# Altium schematic sheet ABC Maker V1.SchDoc: ABC Maker Kit
size A3; Date: 04/08/2016; Author: Bui Nhu The; CompanyName: Ha Noi Maker; Address1: P901, 100 Hoang Quoc Viet; DocumentNumber: 1; SheetNumber: 1; SheetTotal: 1; Title2: V3.1
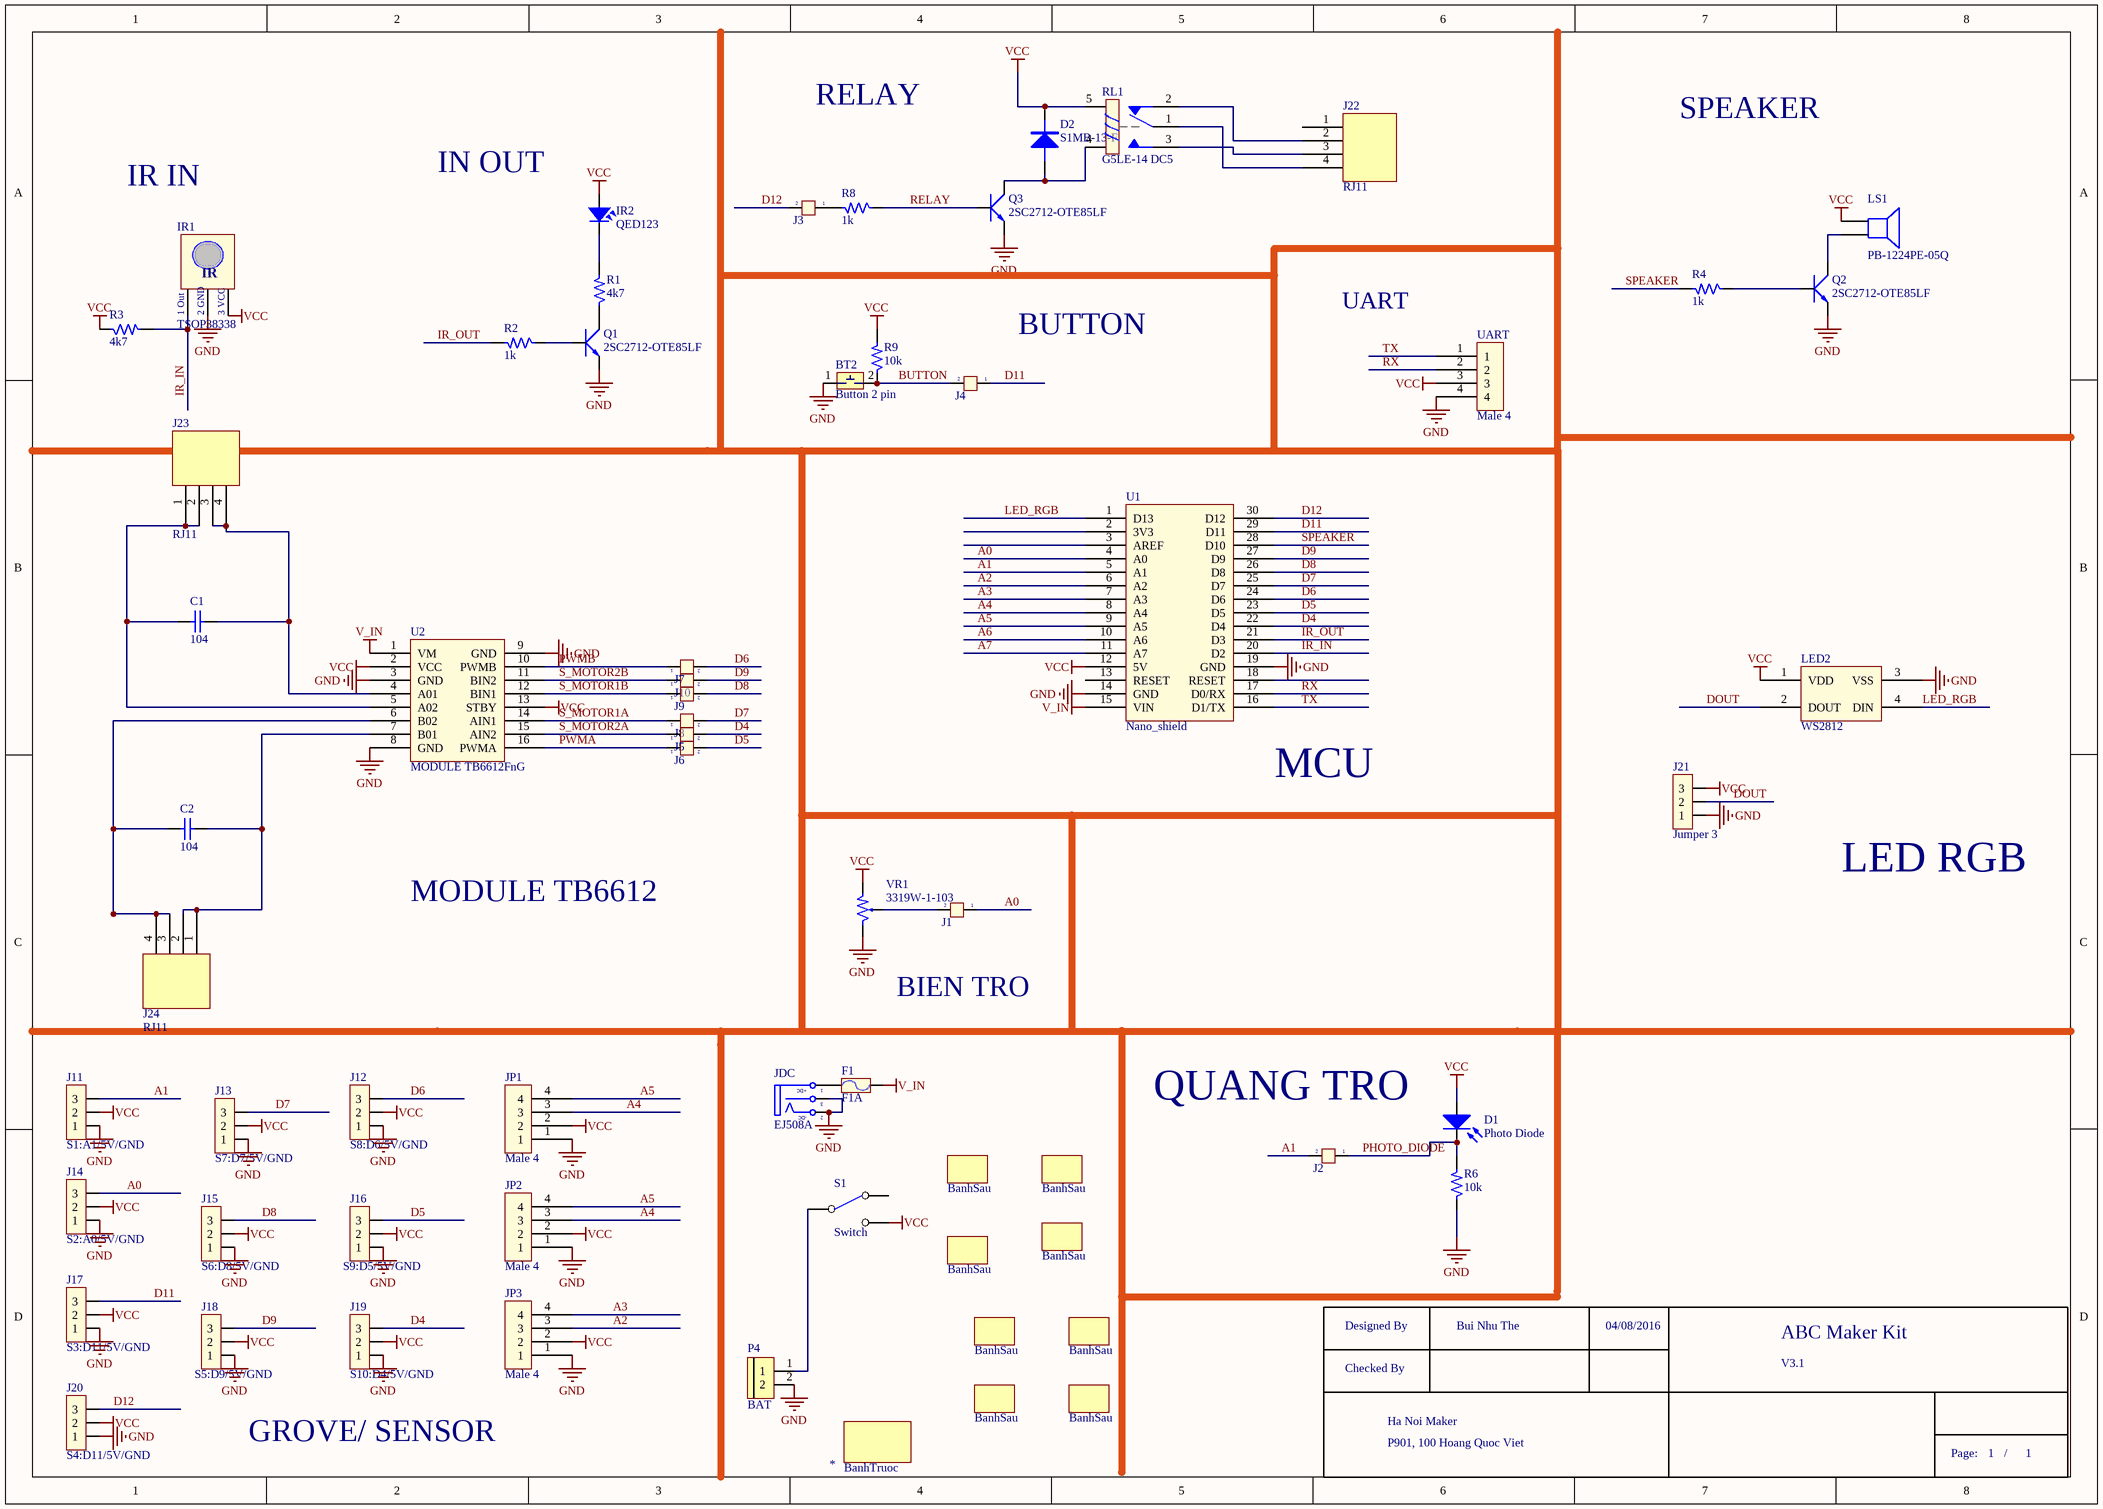
[diagram p0: ABC Maker V1.SchDoc]

## Parts
(Parts that share a designator on the sheet are numbered #1, #2 ... from top to bottom, then left to right.)
*#1  BanhSau  [BanhSau]
*#2  BanhSau  [BanhSau]
*#3  BanhSau  [BanhSau]
*#4  BanhSau  [BanhSau]
*#5  BanhSau  [BanhSau]
*#6  BanhSau  [BanhSau]
*#7  BanhSau  [BanhSau]
*#8  BanhSau  [BanhSau]
*#9  BanhTruoc  [BanhTruoc]
BT2  Button 2 pin
C1  104  [0805]
C2  104  [0805]
D1  Photo Diode  [LED-5 GRe]
D2  S1MB-13-F
F1  F1A  [1206]
IR1  TSOP38338
IR2  QED123
J1  Jumper 2  [JP 2]  (value not drawn)
J2  Jumper 2  [JP 2]  (value not drawn)
J3  Jumper 2  [JP 2]  (value not drawn)
J4  Jumper 2  [JP 2]  (value not drawn)
J5  Jumper 2  [JP 2]  (value not drawn)
J6  Jumper 2  [JP 2]  (value not drawn)
J7  Jumper 2  [JP 2]  (value not drawn)
J8  Jumper 2  [JP 2]  (value not drawn)
J9  Jumper 2  [JP 2]  (value not drawn)
J10  Jumper 2  [JP 2]  (value not drawn)
J11  S1:A1/5V/GND  [JP 3]
J12  S8:D6/5V/GND  [JP 3]
J13  S7:D7/5V/GND  [JP 3]
J14  S2:A0/5V/GND  [JP 3]
J15  S6:D8/5V/GND  [JP 3]
J16  S9:D5/5V/GND  [JP 3]
J17  S3:D11/5V/GND  [JP 3]
J18  S5:D9/5V/GND  [JP 3]
J19  S10:D4/5V/GND  [JP 3]
J20  S4:D11/5V/GND  [JP 3]
J21  Jumper 3  [JP 3]
J22  RJ11
J23  RJ11
J24  RJ11
JDC  EJ508A
JP1  Male 4
JP2  Male 4
JP3  Male 4
LED2  WS2812
LS1  PB-1224PE-05Q
P4  BAT  [CON2]
Q1  2SC2712-OTE85LF
Q2  2SC2712-OTE85LF
Q3  2SC2712-OTE85LF
R1  4k7
R2  1k
R3  4k7
R4  1k
R6  10k
R8  1k
R9  10k
RL1  G5LE-14 DC5
S1  Switch  [Switch]
U1  Nano_shield  [Nano_Shield_Dip]
U2  MODULE TB6612FnG  [TB6612FNG_DIP]
UART  Male 4
VR1  3319W-1-103

## Nets
GND: BT2.1 IR1.2(GND) J11.1 J12.1 J13.1 J14.1 J15.1 J16.1 J17.1 J18.1 J19.1 J20.1 J21.1 JDC.2(TN) JDC.3(S) JP1.1 JP2.1 JP3.1 LED2.3(VSS) P4.2 Q1.1(E) Q2.1(E) Q3.1(E) R6.1 U1.14(GND) U1.19(GND) U2.3(GND) U2.8(GND) U2.9(GND) UART.4 VR1.3
V_IN: F1.2 U1.15(VIN) U2.1(VM)
VCC: D1.1(A) D2.2 IR1.3(VCC) IR2.1 J11.2 J12.2 J13.2 J14.2 J15.2 J16.2 J17.2 J18.2 J19.2 J20.2 J21.3 JP1.2 JP2.2 JP3.2 LED2.1(VDD) LS1.1 R3.1 R9.2 RL1.5 S1.3(NO) U1.12(5V) U2.2(VCC) U2.13(STBY) UART.3 VR1.1
A0: J1.1 J14.3 U1.4(A0)
A1: J2.2 J11.3 U1.5(A1)
A2: JP3.3 U1.6(A2)
A3: JP3.4 U1.7(A3)
A4: JP1.3 JP2.3 U1.8(A4)
A5: JP1.4 JP2.4 U1.9(A5)
A6: U1.10(A6)
A7: U1.11(A7)
BUTTON: BT2.2 J4.2 R9.1
D4: J5.2 J19.3 U1.22(D4)
D5: J6.2 J16.3 U1.23(D5)
D6: J7.2 J12.3 U1.24(D6)
D7: J8.2 J13.3 U1.25(D7)
D8: J9.2 J15.3 U1.26(D8)
D9: J10.2 J18.3 U1.27(D9)
D11: J4.1 J17.3 U1.29(D11)
D12: J3.2 J20.3 U1.30(D12)
DOUT: J21.2 LED2.2(DOUT)
IR_IN: IR1.1(Out) R3.2 U1.20(D2)
IR_OUT: R2.2 U1.21(D3)
LED_RGB: LED2.4(DIN) U1.1(D13)
PHOTO_DIODE: D1.2(K) J2.1 R6.2
PWMA: J6.1 U2.16(PWMA)
PWMB: J7.1 U2.10(PWMB)
RELAY: Q3.3(B) R8.1
RX: U1.17(D0/RX) UART.2
S_MOTOR1A: J8.1 U2.14(AIN1)
S_MOTOR1B: J9.1 U2.12(BIN1)
S_MOTOR2A: J5.1 U2.15(AIN2)
S_MOTOR2B: J10.1 U2.11(BIN2)
SPEAKER: R4.2 U1.28(D10)
TX: U1.16(D1/TX) UART.1
NetC1_1: C1.1 J23.3 J23.4 U2.4(A01)
NetC1_2: C1.2 J23.1 J23.2 U2.5(A02)
NetC2_1: C2.1 J24.1 J24.2 U2.7(B01)
NetC2_2: C2.2 J24.3 J24.4 U2.6(B02)
NetD2_1: D2.1 Q3.2(C) RL1.4
NetF1_1: F1.1 JDC.1(T)
NetIR2_2: IR2.2 R1.2
NetJ1_2: J1.2 VR1.2
NetJ3_1: J3.1 R8.2
NetJ22_2: J22.2 RL1.2
NetJ22_3: J22.3 RL1.3
NetJ22_4: J22.4 RL1.1
NetLS1_2: LS1.2 Q2.2(C)
NetP4_1: P4.1 S1.2(COMMON)
NetQ1_2: Q1.2(C) R1.1
NetQ1_3: Q1.3(B) R2.1
NetQ2_3: Q2.3(B) R4.1

Not connected (* = marked no-connect by the designer): J22 1; S1 1(NC); U1 2(3V3) 3(AREF) 13(RESET) 18(RESET)

## Notes on the sheet
- RELAY
- IN OUT
- SPEAKER
- IR IN
- UART
- BUTTON
- (near U1) MCU
- MODULE TB6612
- LED RGB
- BIEN TRO
- QUANG TRO
- GROVE/ SENSOR
- Designed By
- Checked By
- Page:
- /
- (in symbol EJ508A) +DC; -DC
- (in symbol TSOP38338) IR; 1 Out; 2 GND; 3 VCC

## Library data of the parts
C1 C2 = Cap
D1 = Photo Diode: Photosensitive Diode
D2 = S1MB-13-F: Diode Standard 1000V (1kV) 1A Surface Mount SMB; Manufacturer: Diodes Incorporated; Voltage - Forward (Vf) (Max) @ If: 1.1V @ 1A; Speed: Standard Recovery >500ns, > 200mA (Io); Reverse Recovery Time (trr): 3µs; Current - Reverse Leakage @ Vr: 5µA @ 1000V; Capacitance @ Vr, F: 10pF @ 4V, 1MHz; Supplier 1: Digi-Key; Manufacturer Part Number: S1MB-13-F; RoHS: RoHS Compliant; Category: Discrete Semiconductor Products; Stock 1: 62455; Pricing 1: 1=0.37, 10=0.272, 100=0.1538, 500=0.10198, 1000=0.07821 (USD); Packaging: Cut Tape (CT); Part Status: Active; Diode Type: Standard; Voltage - DC Reverse (Vr) (Max): 1000V (1kV); Current - Average Rectified (Io): 1A; Mounting Type: Surface Mount; Package / Case: DO-214AA, SMB; Supplier Device Package: SMB; Operating Temperature - Junction: -65°C ~ 150°C; ComponentLink1URL: http://www.diodes.com/_files/datasheets/ds16003.pdf; ComponentLink1Description: http://www.diodes.com/_files/datasheets/ds16003.pdf; Supplier Part Number 1: S1MB-FDICT-ND
F1 = Fuse: Designed by: VanDungEvn; Value: Fuse
IR1 = TSOP38338: IC IR RCVR MOD 38KHZ DOME RADIAL; Manufacturer: Vishay Semiconductor Opto Division; Sensing Distance: 45m; B.P.F. Center Frequency: 38.0kHz; Voltage - Supply: 2.5 V ~ 5.5 V; Current - Supply: 450µA; Supplier 1: Digi-Key; Manufacturer Part Number: TSOP38338; RoHS: RoHS Compliant; Category: Sensors, Transducers; Stock 1: 12670; Pricing 1: 1=1.12, 5=1.08, 10=0.878, 25=0.756, 50=0.6548, 100=0.594, 500=0.4995, 1000=0.4455, 5000=0.405 (USD); Part Status: Active; Orientation: Side View; Mounting Type: Through Hole; Operating Temperature: -25°C ~ 85°C (TA); ComponentLink1URL: http://www.vishay.com/docs/81743/tsop381.pdf; ComponentLink1Description: http://www.vishay.com/docs/81743/tsop381.pdf; Supplier Part Number 1: 751-1388-ND
IR2 = QED123: Infrared Emitters 80mW/sr 1.7V IR LED; Manufacturer: Fairchild Semiconductor; Current - DC Forward (If) (Max): 100mA; Radiant Intensity (Ie) Min @ If: 50mW/sr @ 100mA; Wavelength: 880nm; Viewing Angle: 18°; Supplier 1: Digi-Key; Manufacturer Part Number: QED123; RoHS: RoHS Compliant; Category: Optoelectronics; Stock 1: 7509; Pricing 1: 1=0.53, 10=0.412, 25=0.3436, 100=0.296, 250=0.26424, 500=0.22726, 1000=0.17546, 2500=0.15855, 5000=0.14798 (USD); Packaging: Bulk; Part Status: Active; Type: Infrared (IR); Voltage - Forward (Vf) (Typ): 1.7V; Orientation: Top View; Operating Temperature: -40°C ~ 100°C (TA); Mounting Type: Through Hole; Package / Case: Radial; ComponentLink1URL: http://www.fairchildsemi.com/datasheets/QE/QED123.pdf; ComponentLink1Description: http://www.fairchildsemi.com/datasheets/QE/QED123.pdf; Supplier Part Number 1: QED123-ND
J1-J10 = JP 2: Value: JP 2
J11-J20 = JP3_1: Jumper 3; Value: J3
J21 = JP3_1: Value: J3
J22-J24 = 615006138421: Jack Modular Connector 6p6c (RJ11, RJ12, RJ14, RJ25) 90° Angle (Right) Unshielded Cat5; Manufacturer: Wurth Electronics Inc; Number of Ports: 1; LED Color: Does Not Contain LED; Tab Direction: Up; Supplier 1: Digi-Key; Manufacturer Part Number: 615006138421; RoHS: RoHS Compliant; Category: Connectors, Interconnects; Stock 1: 2738; Pricing 1: 1=0.68, 10=0.65, 50=0.625, 100=0.6, 500=0.575 (USD); Packaging: Tray; Part Status: Active; Connector Type: Jack; Number of Positions/Contacts: 6p6c (RJ11, RJ12, RJ14, RJ25); Number of Rows: 1; Mounting Type: Through Hole; Orientation: 90° Angle (Right); Termination: Solder; Shielding: Unshielded; Ratings: Cat5; Features: Board Lock; Ingress Protection: -; Contact Material: Copper Alloy; Contact Finish: Gold; Contact Finish Thickness: -; Housing Material: Polybutylene Terephthalate (PBT); Operating Temperature: -40°C ~ 85°C; ComponentLink1URL: http://katalog.we-online.de/em/datasheet/615006138421.pdf; ComponentLink1Description: http://katalog.we-online.de/em/datasheet/615006138421.pdf; Supplier Part Number 1: 732-2113-ND
JDC = EJ508A: Power Barrel Connector Jack 2.10mm ID (0.083"), 5.50mm OD (0.217") Through Hole, Right Angle; Manufacturer: MPD (Memory Protection Devices); Gender: Male; Number of Positions/Contacts: 2 Conductors, 3 Contacts; Internal Switch(s): Single Switch, Normally Closed; Shielding: Unshielded; Voltage - Rated: 12VDC; Current Rating: 5A; Includes: 1 pc - 1 Connector; Supplier 1: Digi-Key; Manufacturer Part Number: EJ508A; RoHS: RoHS Compliant; Category: Connectors, Interconnects; Stock 1: 8452; Pricing 1: 1=0.83, 10=0.77, 100=0.69, 500=0.61, 1000=0.55 (USD); Packaging: Bulk; Part Status: Active; Connector Type: Jack; Industry Recognized Mating Diameter: 2.10mm ID (0.083"), 5.50mm OD (0.217"); Actual Diameter: -; Mounting Type: Through Hole, Right Angle; Mounting Feature: -; Termination: Solder Eyelet(s); Features: -; Insulation Color: -; Mating Length/Depth: -; Contact Material - Plating: -; Body Material: -; Operating Temperature: -15°C ~ 90°C; ComponentLink1URL: http://www.memoryprotectiondevices.com/datasheets/EJ508A-datasheet.pdf; ComponentLink1Description: http://www.memoryprotectiondevices.com/datasheets/EJ508A-datasheet.pdf; Supplier Part Number 1: EJ508A-ND
JP1-JP3 UART = 68001-104HLF: 4 Positions Header, Unshrouded Connector 0.100" (2.54mm) Through Hole Gold or Gold, GXT™; Manufacturer: Amphenol FCI; Number of Positions: 4; Number of Positions Loaded: All; Supplier 1: Digi-Key; Manufacturer Part Number: 68001-104HLF; RoHS: RoHS Compliant; Category: Connectors, Interconnects; Stock 1: 2426; Pricing 1: 1=0.3, 10=0.287, 25=0.2456, 100=0.2007, 250=0.1802, 500=0.172, 1000=0.14333, 2500=0.13104, 5000=0.12285 (USD); Packaging: Bulk; Part Status: Active; Contact Type: Male Pin; Connector Type: Header, Unshrouded; Pitch: 0.100" (2.54mm); Number of Rows: 1; Row Spacing: -; Contact Mating Length: 0.230" (5.84mm); Mounting Type: Through Hole; Termination: Solder; Fastening Type: -; Features: -; Contact Finish: Gold or Gold, GXT™; Contact Finish Thickness: 30µin (0.76µm); Color: Black; ComponentLink1URL: http://portal.fciconnect.com/Comergent//fci/drawing/68000.pdf; ComponentLink1Description: http://portal.fciconnect.com/Comergent//fci/drawing/68000.pdf; Supplier Part Number 1: 609-3271-ND
LED2 = 1655: LED RGB WS2812 OR SK6812 1=10; Manufacturer: Adafruit Industries LLC; Configuration: Discrete; Number of LEDs: 10; Color: Red, Green, Blue (RGB); Utilized LED: SK6812 or WS2812; Supplier 1: Digi-Key; Manufacturer Part Number: 1655; RoHS: RoHS Compliant; Category: Optoelectronics; Stock 1: 8506; Pricing 1: 1=4.5, 10=4.05 (USD); Part Status: Active; Controller Type: -; Interface: -; Mounting Type: Surface Mount; Size / Dimension: 5.00mm L x 5.00mm W; ComponentLink1URL: http://www.adafruit.com/datasheets/WS2812B.pdf; ComponentLink1Description: http://www.adafruit.com/datasheets/WS2812B.pdf; Supplier Part Number 1: 1528-1104-ND
LS1 = PB-1224PE-05Q: Peak-Peak Signal Buzzer Single Tone 2.4kHz Magnetic 4.5 ~ 5.5V 85dB @ 5V, 10cm; Manufacturer: Mallory Sonalert Products Inc.; Driver Circuitry: Transducer, Externally Driven; Current - Supply: 50mA; Port Location: Top; Ratings: Washable; Supplier 1: Digi-Key; Manufacturer Part Number: PB-1224PE-05Q; RoHS: RoHS Compliant; Category: Audio Products; Stock 1: 6832; Pricing 1: 1=1.25, 10=1.073, 25=0.8624, 50=0.7664, 100=0.6706, 250=0.65144, 500=0.63228, 1000=0.5748, 5000=0.51732 (USD); Packaging: Bulk; Part Status: Active; Input Type: Peak-Peak Signal; Voltage - Rated: 5V; Voltage Range: 4.5 ~ 5.5V; Frequency: 2.4kHz; Technology: Magnetic; Operating Mode: Single Tone; Duration: -; Sound Pressure Level: 85dB @ 5V, 10cm; Operating Temperature: -20°C ~ 70°C; Approvals: -; Mounting Type: Through Hole; Termination: PC Pins; Size / Dimension: 12.0mm Dia x 9.7mm H; Height - Seated (Max): *; ComponentLink1URL: http://www.mallory-sonalert.com/specifications/PB-1224PE-05Q.pdf; ComponentLink1Description: http://www.mallory-sonalert.com/specifications/PB-1224PE-05Q.pdf; Supplier Part Number 1: 458-1062-ND
P4 = Header 2: Big Header 2
Q1-Q3 = 2SC2712-OTE85LF: TRANS NPN 50V 0.15A S-MINI; Manufacturer: Toshiba Semiconductor and Storage; Current - Collector (Ic) (Max): 150mA; Vce Saturation (Max) @ Ib, Ic: 250mV @ 10mA, 100mA; Current - Collector Cutoff (Max): 100nA (ICBO); DC Current Gain (hFE) (Min) @ Ic, Vce: 70 @ 2mA, 6V; Power - Max: 150mW; Frequency - Transition: 80MHz; Supplier 1: Digi-Key; Manufacturer Part Number: 2SC2712-OTE85LF; RoHS: RoHS Compliant; Category: Discrete Semiconductor Products; Stock 1: 3000; Pricing 1: 1=0.21, 10=0.193, 25=0.1392, 100=0.1082, 250=0.068, 500=0.05794, 1000=0.0394 (USD); Packaging: Cut Tape (CT); Part Status: Active; Transistor Type: NPN; Voltage - Collector Emitter Breakdown (Max): 50V; Mounting Type: Surface Mount; Package / Case: TO-236-3, SC-59, SOT-23-3; Supplier Device Package: TO-236; ComponentLink1URL: http://toshiba.semicon-storage.com/info/docget.jsp?did=19227&prodName=2SC2712; ComponentLink1Description: http://toshiba.semicon-storage.com/info/docget.jsp?did=19227&prodName=2SC2712; Supplier Part Number 1: 2SC2712-OTE85LFCT-ND
R1 R3 = MCR10ERTJ472: RES SMD 4k7 OHM 5% 1/8W 0805; Manufacturer: Rohm Semiconductor; Resistance (Ohms): 4.7k; Power (Watts): 0.125W, 1/8W; Temperature Coefficient: ±200ppm/°C; Supplier 1: Digi-Key; Manufacturer Part Number: MCR10ERTJ472; RoHS: RoHS Compliant; Category: Resistors; Stock 1: 14288; Pricing 1: 1=0.1, 10=0.026, 25=0.0184, 100=0.0104, 250=0.00792, 500=0.00634, 1000=0.00466 (USD); Packaging: Cut Tape (CT); Part Status: Active; Tolerance: ±5%; Composition: Thick Film; Features: -; Operating Temperature: -55°C ~ 155°C; Package / Case: 0805 (2012 Metric); Supplier Device Package: 0805; Size / Dimension: 0.079" L x 0.049" W (2.00mm x 1.25mm); Height: 0.024" (0.60mm); Number of Terminations: 2; Failure Rate: -; ComponentLink1URL: http://rohmfs.rohm.com/en/products/databook/datasheet/passive/resistor/chip_resistor/mcr_g.pdf; ComponentLink1Description: http://rohmfs.rohm.com/en/products/databook/datasheet/passive/resistor/chip_resistor/mcr_g.pdf; Supplier Part Number 1: RHM4.7KCPCT-ND
R2 R4 R8 = MCR10ERTJ102: RES SMD 1K OHM 5% 1/8W 0805; Manufacturer: Rohm Semiconductor; Power (Watts): 0.125W, 1/8W; Temperature Coefficient: ±200ppm/°C; Supplier 1: Digi-Key; Manufacturer Part Number: MCR10ERTJ102; RoHS: RoHS Compliant; Category: Resistors; Stock 1: 21676; Pricing 1: 1=0.1, 10=0.026, 25=0.0184, 100=0.0104, 250=0.00792, 500=0.00634, 1000=0.00466 (USD); Packaging: Cut Tape (CT); Part Status: Active; Resistance (Ohms): 1k; Tolerance: ±5%; Composition: Thick Film; Features: -; Operating Temperature: -55°C ~ 155°C; Package / Case: 0805 (2012 Metric); Supplier Device Package: 0805; Size / Dimension: 0.079" L x 0.049" W (2.00mm x 1.25mm); Height: 0.024" (0.60mm); Number of Terminations: 2; Failure Rate: -; ComponentLink1URL: http://rohmfs.rohm.com/en/products/databook/datasheet/passive/resistor/chip_resistor/mcr_g.pdf; ComponentLink1Description: http://rohmfs.rohm.com/en/products/databook/datasheet/passive/resistor/chip_resistor/mcr_g.pdf; Supplier Part Number 1: RHM1.0KCPCT-ND
R6 R9 = MCR10ERTJ103: RES SMD 10K OHM 5% 1/8W 0805; Manufacturer: Rohm Semiconductor; Power (Watts): 0.125W, 1/8W; Temperature Coefficient: ±200ppm/°C; Supplier 1: Digi-Key; Manufacturer Part Number: MCR10ERTJ103; RoHS: RoHS Compliant; Category: Resistors; Stock 1: 28201; Pricing 1: 1=0.1, 10=0.026, 25=0.0184, 100=0.0104, 250=0.00792, 500=0.00634, 1000=0.00466 (USD); Packaging: Cut Tape (CT); Part Status: Active; Resistance (Ohms): 10k; Tolerance: ±5%; Composition: Thick Film; Features: -; Operating Temperature: -55°C ~ 155°C; Package / Case: 0805 (2012 Metric); Supplier Device Package: 0805; Size / Dimension: 0.079" L x 0.049" W (2.00mm x 1.25mm); Height: 0.024" (0.60mm); Number of Terminations: 2; Failure Rate: -; ComponentLink1URL: http://rohmfs.rohm.com/en/products/databook/datasheet/passive/resistor/chip_resistor/mcr_g.pdf; ComponentLink1Description: http://rohmfs.rohm.com/en/products/databook/datasheet/passive/resistor/chip_resistor/mcr_g.pdf; Supplier Part Number 1: RHM10KCPCT-ND; .SCHCHECK: *; .CREATOR: *
RL1 = G5LE-14 DC5: General Purpose Relay SPDT (1 Form C) 5VDC Coil Through Hole; Manufacturer: Omron Electronics Inc-EMC Div; Coil Type: Non Latching; Coil Current: 79.4mA; Contact Rating (Current): 10A; Switching Voltage: 250VAC, 125VDC - Max; Turn On Voltage (Max): 3.75 VDC; Turn Off Voltage (Min): 0.5 VDC; Operate Time: 10ms; Release Time: 5ms; Coil Power: 400 mW; Coil Resistance: 63 Ohms; Supplier 1: Digi-Key; Manufacturer Part Number: G5LE-14 DC5; RoHS: RoHS Compliant; Category: Relays; Stock 1: 11549; Pricing 1: 1=1.44, 10=1.35, 25=1.2004, 50=1.1404, 100=1.0804, 250=0.96032, 500=0.9003, 1000=0.84028, 2500=0.82528 (USD); Packaging: Tray; Part Status: Active; Relay Type: General Purpose; Coil Voltage: 5VDC; Contact Form: SPDT (1 Form C); Features: Insulation - Class B, Sealed - Fully; Mounting Type: Through Hole; Termination Style: PC Pin; Contact Material: Silver Tin Oxide (AgSnO); Operating Temperature: -40°C ~ 85°C; ComponentLink1URL: http://www.omron.com/ecb/products/pdf/en-g5le.pdf; ComponentLink1Description: http://www.omron.com/ecb/products/pdf/en-g5le.pdf; Supplier Part Number 1: Z1011-ND
VR1 = 3319W-1-103: 10k Ohm 0.2W, 1/5W PC Pins Through Hole Trimmer Potentiometer Carbon 1 Turn Side Adjustment; Manufacturer: Bourns Inc.; Tolerance: ±25%; Temperature Coefficient: ±1000ppm/°C; Number of Turns: 1; Supplier 1: Digi-Key; Manufacturer Part Number: 3319W-1-103; RoHS: RoHS Compliant; Category: Potentiometers, Variable Resistors; Stock 1: 1524; Pricing 1: 1=0.4, 10=0.366, 25=0.33, 50=0.319, 100=0.308, 250=0.286, 500=0.264, 1000=0.2475, 2500=0.209 (USD); Packaging: Bulk; Part Status: Active; Resistance (Ohms): 10k; Power (Watts): 0.2W, 1/5W; Adjustment Type: Side Adjustment; Resistive Material: Carbon; Mounting Type: Through Hole; Termination Style: PC Pins; Size / Dimension: Rectangular - 0.354" x 0.433" Face x 0.492" H (9.00mm x 11.00mm x 12.50mm); ComponentLink1URL: http://www.bourns.com/docs/Product-Datasheets/3319.pdf; ComponentLink1Description: http://www.bourns.com/docs/Product-Datasheets/3319.pdf; Supplier Part Number 1: 3319W-1-103-ND